# Altium schematic sheet 600米舵机电容板V1.0.SchDoc
size A4; SheetNumber: 1; SheetTotal: 1
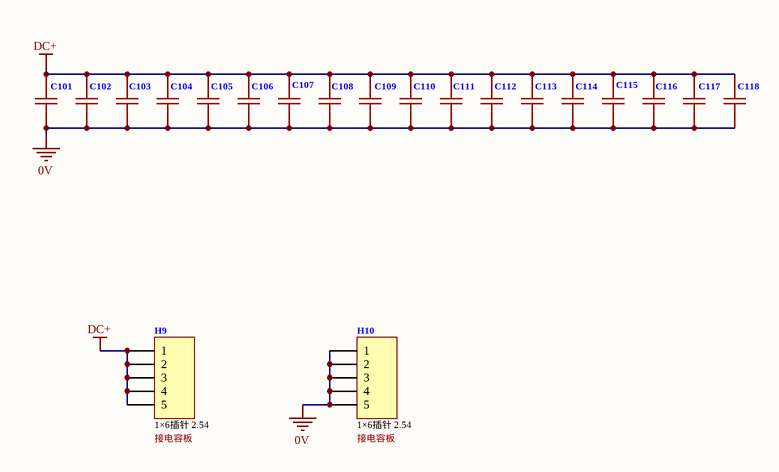
[diagram p0: 600米舵机电容板V1.0.SchDoc]

## Parts
C101  4.7uf 100V  [1210_C]  (value not drawn)
C102  4.7uf 100V  [1210_C]  (value not drawn)
C103  4.7uf 100V  [1210_C]  (value not drawn)
C104  4.7uf 100V  [1210_C]  (value not drawn)
C105  4.7uf 100V  [1210_C]  (value not drawn)
C106  4.7uf 100V  [1210_C]  (value not drawn)
C107  4.7uf 100V  [1210_C]  (value not drawn)
C108  4.7uf 100V  [1210_C]  (value not drawn)
C109  4.7uf 100V  [1210_C]  (value not drawn)
C110  4.7uf 100V  [1210_C]  (value not drawn)
C111  4.7uf 100V  [1210_C]  (value not drawn)
C112  4.7uf 100V  [1210_C]  (value not drawn)
C113  4.7uf 100V  [1210_C]  (value not drawn)
C114  4.7uf 100V  [1210_C]  (value not drawn)
C115  4.7uf 100V  [1210_C]  (value not drawn)
C116  4.7uf 100V  [1210_C]  (value not drawn)
C117  4.7uf 100V  [1210_C]  (value not drawn)
C118  4.7uf 100V  [1210_C]  (value not drawn)
H9  1×6插针 2.54  [HDR1X5]
H10  1×6插针 2.54  [HDR1X5]

## Nets
0V: C101.1 C102.1 C103.1 C104.1 C105.1 C106.1 C107.1 C108.1 C109.1 C110.1 C111.1 C112.1 C113.1 C114.1 C115.1 C116.1 C117.1 C118.1 H10.1 H10.2 H10.3 H10.4 H10.5
DC+: C101.2 C102.2 C103.2 C104.2 C105.2 C106.2 C107.2 C108.2 C109.2 C110.2 C111.2 C112.2 C113.2 C114.2 C115.2 C116.2 C117.2 C118.2 H9.1 H9.2 H9.3 H9.4 H9.5

## Notes on the sheet
- (near H9) 接电容板
- (near H10) 接电容板

## Library data of the parts
C101-C118 = 1210 4.7uf: 贴片电容; Manufacturer: FH(风华); Symbol: 1210B475K101NT; Add into BOM: yes; Tolerance: ±10%; Temperature Coefficient: X7R; Device: 1210B475K101NT; LCSC Part Name: 4.7uF ±10% 100V; Supplier Part: C2840282; Manufacturer Part: 1210B475K101NT; Supplier Footprint: 1210; JLCPCB Part Class: Extended Part; Datasheet: https://atta.szlcsc.com/upload/public/pdf/source/20210617/C2840282_5B7AB5BFD77495008CFAB3FC2796A0E9.pdf; Supplier: LCSC; Convert to PCB: yes; Value: 4.7uF; Voltage Rated: 100V
H9 H10 = Header 5: Header, 5-Pin; LatestRevisionDate: 17-Jul-2002; LatestRevisionNote: Re-released for DXP Platform.; Publisher: Altium Limited